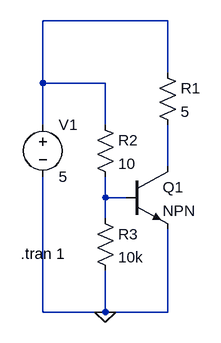
[diagram p0: schematic NPN_test.asc]
NPN_test.asc, the LTspice schematic file:
Version 4
SHEET 1 880 680
WIRE 240 -64 48 -64
WIRE 240 16 240 -64
WIRE 48 32 48 -64
WIRE 144 32 48 32
WIRE 48 96 48 32
WIRE 144 96 144 32
WIRE 240 160 240 96
WIRE 144 208 144 176
WIRE 176 208 144 208
WIRE 144 240 144 208
WIRE 48 384 48 176
WIRE 144 384 144 320
WIRE 144 384 48 384
WIRE 240 384 240 256
WIRE 240 384 144 384
FLAG 144 384 0
SYMBOL npn 176 160 R0
SYMATTR InstName Q1
SYMBOL res 224 0 R0
SYMATTR InstName R1
SYMATTR Value 5
SYMBOL voltage 48 80 R0
WINDOW 123 0 0 Left 0
WINDOW 39 0 0 Left 0
SYMATTR InstName V1
SYMATTR Value 5
SYMBOL res 128 80 R0
SYMATTR InstName R2
SYMATTR Value 10
SYMBOL res 128 224 R0
SYMATTR InstName R3
SYMATTR Value 10k
TEXT 14 294 Left 2 !.tran 1

The netlist it stands for:
* NPN_test.asc
Q1 N002 N003 0 0 NPN
R1 N001 N002 5
V1 N001 0 5
R2 N001 N003 10
R3 N003 0 10k
.model NPN NPN
.model PNP PNP
.lib standard.bjt
.tran 1
.backanno
.end